# EAGLE design a22 (EAGLE 7.4.0)
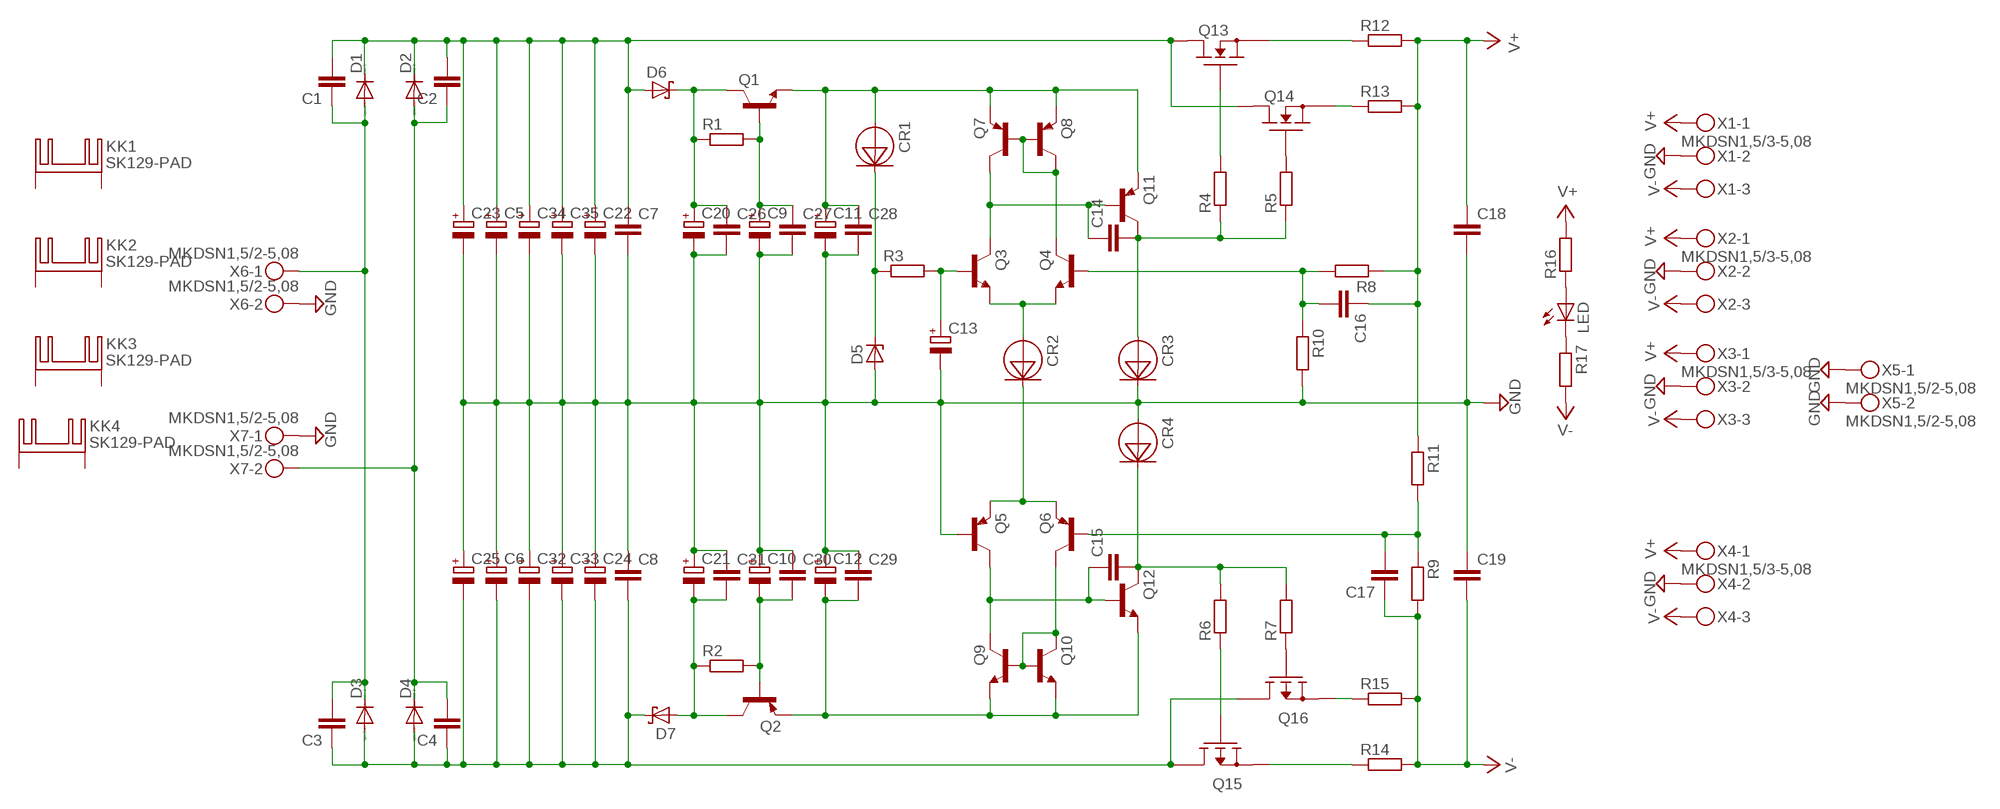
[diagram p0: schematic, sheet 1]

## Parts
C1  C-EU025_050-025X075  [C025_050-025X075]
C2  C-EU025_050-025X075  [C025_050-025X075]
C3  C-EU025_050-025X075  [C025_050-025X075]
C4  C-EU025_050-025X075  [C025_050-025X075]
C5  CPOL-EUE10-30  [EB30D]
C6  CPOL-EUE10-30  [EB30D]
C7  C-EU050-075X075  [C050-075X075]
C8  C-EU050-075X075  [C050-075X075]
C9  CPOL-EUE5-10.5  [E5-10,5]
C10  CPOL-EUE5-10.5  [E5-10,5]
C11  CPOL-EUE5-13  [E5-13]
C12  CPOL-EUE5-13  [E5-13]
C13  CPOL-EUE5-10.5  [E5-10,5]
C14  C-EU050-075X075  [C050-075X075]
C15  C-EU050-075X075  [C050-075X075]
C16  C-EU025_050-045X075  [C025_050-045X075]
C17  C-EU025_050-045X075  [C025_050-045X075]
C18  C-EU050-075X075  [C050-075X075]
C19  C-EU050-075X075  [C050-075X075]
C20  CPOL-EUE5-10.5  [E5-10,5]
C21  CPOL-EUE5-10.5  [E5-10,5]
C22  CPOL-EUE7.5-18  [E7,5-18]
C23  CPOL-EUE7.5-18  [E7,5-18]
C24  CPOL-EUE7.5-18  [E7,5-18]
C25  CPOL-EUE7.5-18  [E7,5-18]
C26  C-EU050-035X075  [C050-035X075]
C27  C-EU050-035X075  [C050-035X075]
C28  C-EU050-035X075  [C050-035X075]
C29  C-EU050-035X075  [C050-035X075]
C30  C-EU050-035X075  [C050-035X075]
C31  C-EU050-035X075  [C050-035X075]
C32  CPOL-EUE7.5-18  [E7,5-18]
C33  CPOL-EUE7.5-18  [E7,5-18]
C34  CPOL-EUE7.5-18  [E7,5-18]
C35  CPOL-EUE7.5-18  [E7,5-18]
CR1  E-202  [DO-35-3]
CR2  E-202  [DO-35-3]
CR3  E-202  [DO-35-3]
CR4  E-202  [DO-35-3]
D1  MUR810  [TO220ACS]
D2  MUR810  [TO220ACS]
D3  MUR810  [TO220ACS]
D4  MUR810  [TO220ACS]
D5  BZX90  [DO34Z7]
D6  1N5819-B  [DO41-7.6]
D7  1N5819-B  [DO41-7.6]
KK1  SK129-PAD  [SK129]
KK2  SK129-PAD  [SK129]
KK3  SK129-PAD  [SK129]
KK4  SK129-PAD  [SK129]
LED  LED5MM  [LED5MM]
Q1  BC550B  [TO92-EBC]
Q2  BC560C  [TO92-EBC]
Q3  BC550B  [TO92-EBC]
Q4  BC550B  [TO92-EBC]
Q5  BC560C  [TO92-EBC]
Q6  BC560C  [TO92-EBC]
Q7  BC560C  [TO92-EBC]
Q8  BC560C  [TO92-EBC]
Q9  BC550B  [TO92-EBC]
Q10  BC550B  [TO92-EBC]
Q11  BC560C  [TO92-EBC]
Q12  BC550B  [TO92-EBC]
Q13  IRFZ24N  [TO220V]
Q14  IRFZ24N  [TO220V]
Q15  IRF9Z34N  [TO220V]
Q16  IRF9Z34N  [TO220V]
R1  R-EU_0309/10  [0309/10]
R2  R-EU_0309/10  [0309/10]
R3  R-EU_0309/10  [0309/10]
R4  R-EU_0309/10  [0309/10]
R5  R-EU_0309/10  [0309/10]
R6  R-EU_0309/10  [0309/10]
R7  R-EU_0309/10  [0309/10]
R8  R-EU_0309/10  [0309/10]
R9  R-EU_0309/10  [0309/10]
R10  R-EU_0309/10  [0309/10]
R11  R-EU_0309/10  [0309/10]
R12  R-EU_0617/17  [0617/17]
R13  R-EU_0617/17  [0617/17]
R14  R-EU_0617/17  [0617/17]
R15  R-EU_0617/17  [0617/17]
R16  R-EU_0309/10  [0309/10]
R17  R-EU_0309/10  [0309/10]
X1  MKDSN1,5/3-5,08  [MKDSN1,5/3-5,08]
X2  MKDSN1,5/3-5,08  [MKDSN1,5/3-5,08]
X3  MKDSN1,5/3-5,08  [MKDSN1,5/3-5,08]
X4  MKDSN1,5/3-5,08  [MKDSN1,5/3-5,08]
X5  MKDSN1,5/2-5,08  [MKDSN1,5/2-5,08]
X6  MKDSN1,5/2-5,08  [MKDSN1,5/2-5,08]
X7  MKDSN1,5/2-5,08  [MKDSN1,5/2-5,08]

## Nets
GND: C5.- C6.+ C7.2 C8.1 C9.- C10.+ C11.- C12.+ C13.- C18.2 C19.1 C20.- C21.+ C22.- C23.- C24.+ C25.+ C26.2 C27.2 C28.2 C29.1 C30.1 C31.1 C32.+ C33.+ C34.- C35.- CR3.1(CATHODE) CR3.2(CATHODE) CR3.CATHODE CR4.ANODE D5.A Q5.B R10.2 X1.2 X2.2 X3.2 X4.2 X5.1 X5.2 X6.2 X7.1
N$1: C1.1 C3.2 C3.3 D1.A D3.C X6.1
N$2: C2.1 C4.2 C4.3 D2.A D4.C X7.2
N$3: C20.+ C26.1 D6.C Q1.C R1.1
N$4: Q13.1(G) R4.2
N$5: C9.+ C27.1 Q1.B R1.2
N$6: C10.- C30.2 Q2.B R2.2
N$7: C3.1 C4.1 C6.- C8.2 C24.- C25.- C32.- C33.- D3.A D4.A D7.C Q15.2(D) Q16.2(D)
N$8: C21.- C31.2 D7.A Q2.C R2.1
N$9: C11.+ C28.1 CR1.ANODE Q1.E Q7.E Q8.E Q11.E
N$10: LED.A R16.1
N$11: CR1.1(CATHODE) CR1.2(CATHODE) CR1.CATHODE D5.C R3.1
N$12: C12.- C29.2 Q2.E Q9.E Q10.E Q12.E
N$13: CR2.1(CATHODE) CR2.2(CATHODE) CR2.CATHODE Q5.E Q6.E
N$14: CR2.ANODE Q3.E Q4.E
N$15: C13.+ Q3.B R3.2
N$16: Q4.C Q7.B Q8.B Q8.C
N$17: Q6.C Q9.B Q10.B Q10.C
N$18: C15.1 Q5.C Q9.C Q12.B
N$19: C1.2 C1.3 C2.2 C2.3 C5.+ C7.1 C22.+ C23.+ C34.+ C35.+ D1.C D2.C D6.A Q13.2(D) Q14.2(D)
N$20: C17.2 C17.3 Q6.B R9.1 R11.2
N$21: C14.1 Q3.C Q7.C Q11.B
N$22: C14.2 CR3.ANODE Q11.C R4.1 R5.1
N$23: C15.2 CR4.1(CATHODE) CR4.2(CATHODE) CR4.CATHODE Q12.C R6.2 R7.2
N$24: Q14.1(G) R5.2
N$25: Q16.1(G) R7.1
N$26: LED.K(C) R17.1
N$27: Q15.1(G) R6.1
N$28: C16.2 C16.3 Q4.B R8.2 R10.1
N$30: Q16.3(S) R15.1
N$31: Q15.3(S) R14.1
N$33: Q13.3(S) R12.1
N$34: Q14.3(S) R13.1
V+: C16.1 C18.1 R8.1 R11.1 R12.2 R13.2 R16.2 X1.1 X2.1 X3.1 X4.1
V-: C17.1 C19.2 R9.2 R14.2 R15.2 R17.2 X1.3 X2.3 X3.3 X4.3
Unconnected: KK1.A2,5(K) KK1.B2,5(K) KK2.A2,5(K) KK2.B2,5(K) KK3.A2,5(K) KK3.B2,5(K) KK4.A2,5(K) KK4.B2,5(K)

## Library data of the parts
C1-C4 C7 C8 C14-C19 C26-C31 = Vwvwbg:C-EU: CAPACITOR, European symbol
C5 C6 C9-C13 C20-C25 C32-C35 = Vwvwbg:CPOL-EU: POLARIZED CAPACITOR, European symbol
CR1-CR4 = crd:E-202
D1-D4 = diode:MUR810: DIODE
D5 = diode:BZX90: Z DIODE
D6 D7 = diode:1N581*: 1.0A SCHOTTKY BARRIER RECTIFIER Source: http://www.diodes.com/datasheets/ds23001.pdf
KK1-KK4 = heatsinkfix:SK129-PAD: HEATSINK manufacturer Fischer/distributor Buerklin
LED = led:LED: LED OSRAM: - CHIPLED LG R971, LG N971, LY N971, LG Q971, LY Q971, LO R971, LY R971 LH N974, LH R974 LS Q976, LO Q976, LY Q976 LO Q996 - Hyper CHIPLED LW Q18S LB Q993, LB Q99A, LB R99A - SideLED LS A670, LO A670, LY A670, LG A670, LP A670 LB A673, LV A673, LT A673, LW A673 LH A674 LY A675 LS A676, LA A676, LO A676, LY A676, LW A676 LS A679, LY A679, LG A679 - Hyper Micro SIDELED® LS Y876, LA Y876, LO Y876, LY Y876 LT Y87S - SmartLED LW L88C, LW L88S LB L89C, LB L89S, LG L890 LS L89K, LO L89K, LY L89K LS L896, LA L896, LO L896, LY L896 - TOPLED LS T670, LO T670, LY T670, LG T670, LP T670 LSG T670, LSP T670, LSY T670, LOP T670, LYG T670 LG T671, LOG T671, LSG T671 LB T673, LV T673, LT T673, LW T673 LH T674 LS T676, LA T676, LO T676, LY T676, LB T676, LH T676, LSB T676, LW T676 LB T67C, LV T67C, LT T67C, LS T67K, LO T67K, LY T67K, LW E67C LS E67B, LA E67B, LO E67B, LY E67B, LB E67C, LV E67C, LT E67C LW T67C LS T679, LY T679, LG T679 LS T770, LO T770, LY T770, LG T770, LP T770 LB T773, LV T773, LT T773, LW T773 LH T774 LS E675, LA E675, LY E675, LS T675 LS T776, LA T776, LO T776, LY T776, LB T776 LHGB T686 LT T68C, LB T68C - Hyper Mini TOPLED® LB M676 - Mini TOPLED Santana® LG M470 LS M47K, LO M47K, LY M47K Source: http://www.osram.convergy.de LUXEON: - LUMILED® LXK2-PW12-R00, LXK2-PW12-S00, LXK2-PW14-U00, LXK2-PW14-V00 LXK2-PM12-R00, LXK2-PM12-S00, LXK2-PM14-U00 LXK2-PE12-Q00, LXK2-PE12-R00, LXK2-PE12-S00, LXK2-PE14-T00, LXK2-PE14-U00 LXK2-PB12-K00, LXK2-PB12-L00, LXK2-PB12-M00, LXK2-PB14-N00, LXK2-PB14-P00, LXK2-PB14-Q00 LXK2-PR12-L00, LXK2-PR12-M00, LXK2-PR14-Q00, LXK2-PR14-R00 LXK2-PD12-Q00, LXK2-PD12-R00, LXK2-PD12-S00 LXK2-PH12-R00, LXK2-PH12-S00 LXK2-PL12-P00, LXK2-PL12-Q00, LXK2-PL12-R00 Source: www.luxeon.com KINGBRIGHT: KA-3528ASYC Source: www.kingbright.com
Q1 Q3 Q4 Q9 Q10 Q12 = tranzistory NPN:BC550*: NPN Transistor
Q2 Q5-Q8 Q11 = transistor-pnp:BC560*: PNP Transistror
Q13 Q14 = transistor-fet:IRFZ24N
Q15 Q16 = transistor-fet:IRF9Z34N
R1-R17 = Vwvwbg:R-EU_: RESISTOR, European symbol
X1-X4 = con-phoenix-508:MKDSN1,5/3-5,08: MKDSN 1,5/ 3-5,08 Printklemme Nennstrom: 13,5 A Nennspannung: 250 V Rastermaß: 5,08 mm Polzahl: 3 Anschlussart: Schraubanschluss Montage: Löten Anschlussrichtung Leiter/Platine: 0 ° Artikelnummer: 1729131 Source: http://eshop.phoenixcontact.com .. 1729131.pdf
X5-X7 = con-phoenix-508:MKDSN1,5/2-5,08: MKDSN 1,5/ 2-5,08 Printklemme Nennstrom: 13,5 A Nennspannung: 250 V Rastermaß: 5,08 mm Polzahl: 2 Anschlussart: Schraubanschluss Montage: Löten Anschlussrichtung Leiter/Platine: 0 ° Artikelnummer: 1729128 Source: http://eshop.phoenixcontact.com .. 1729128.pdf

## Board
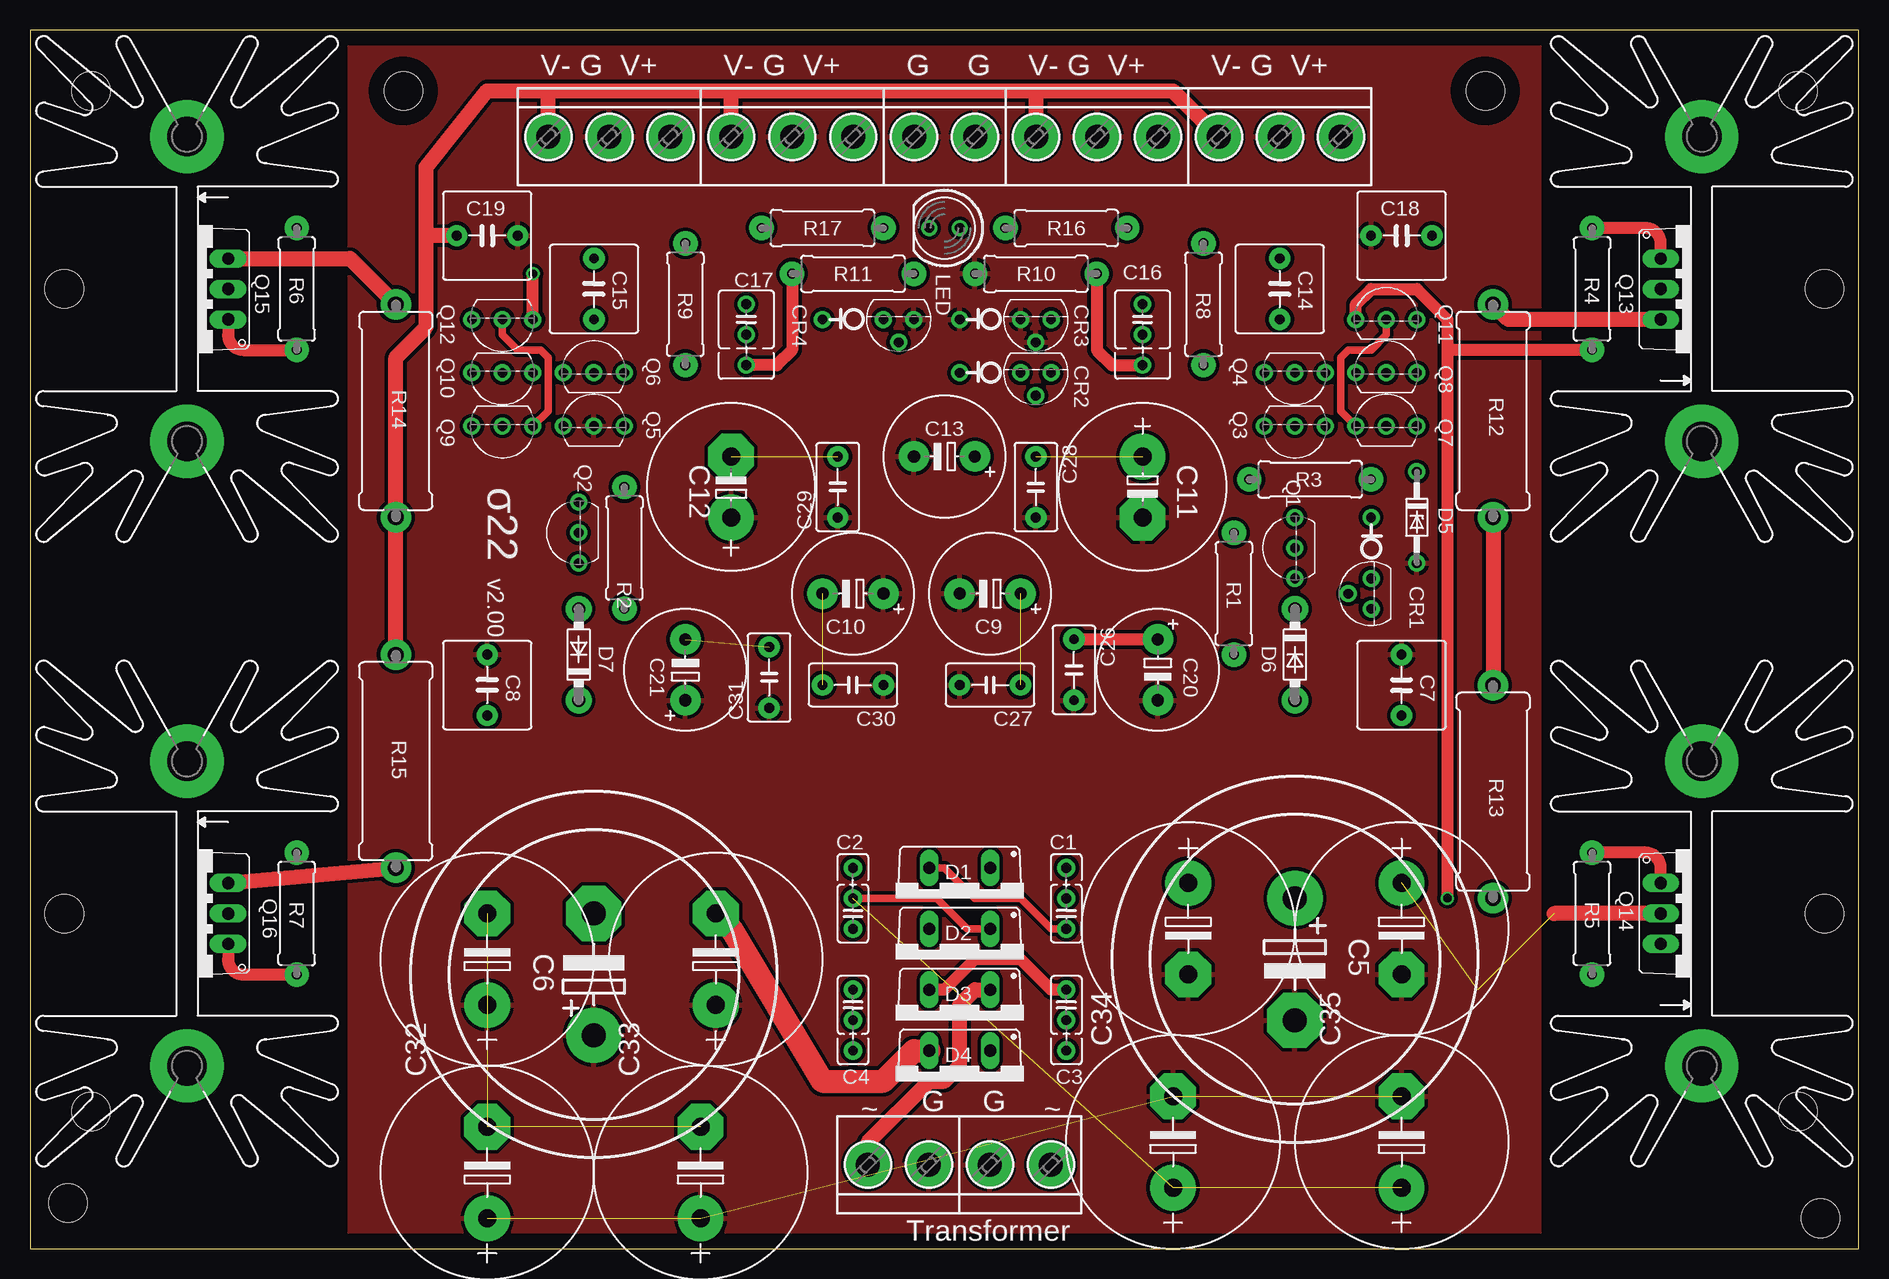
[diagram p1: board, top side]
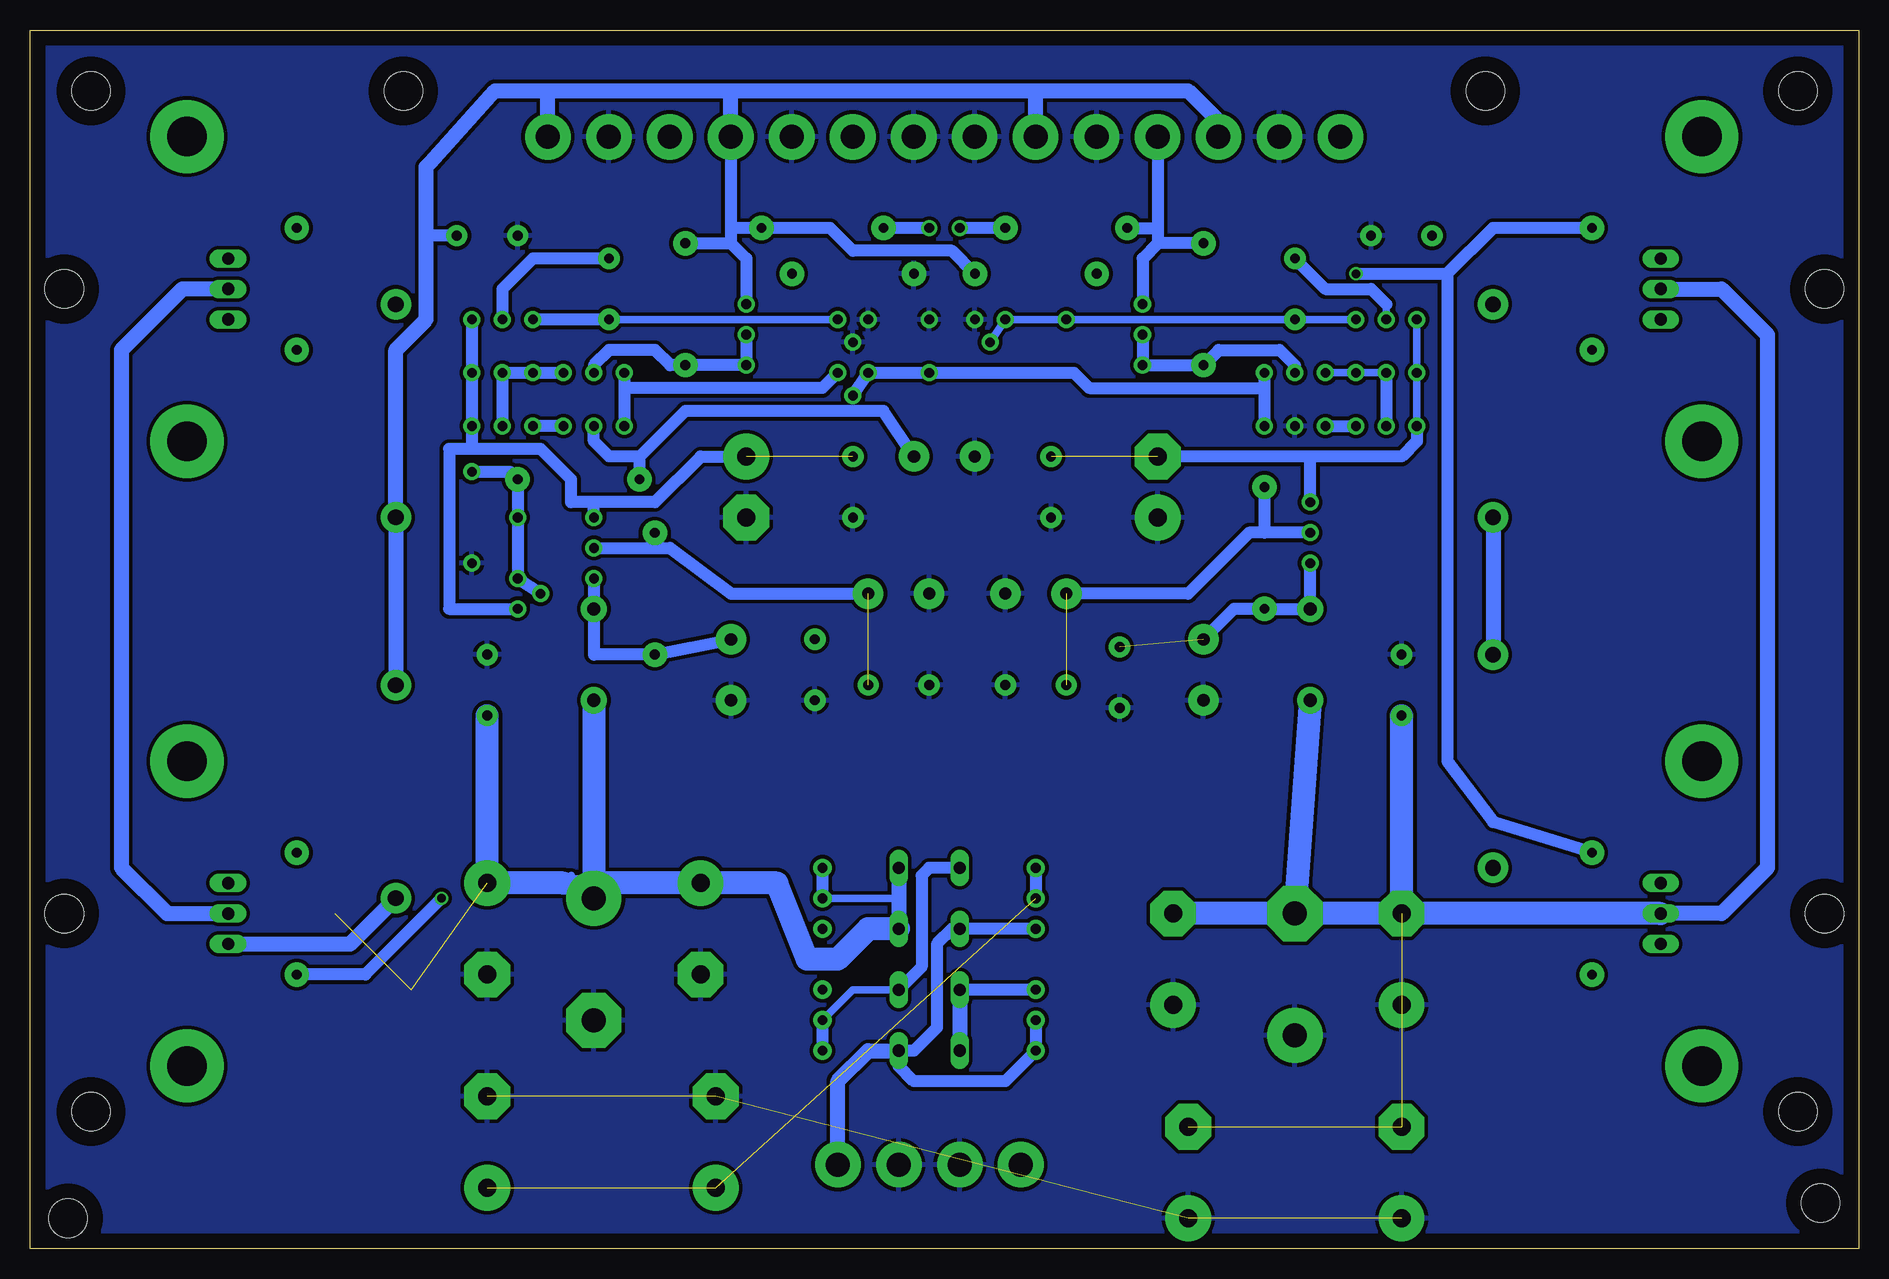
[diagram p2: board, bottom side, seen from below]

Size 152.4 x 101.6 mm. Coordinates in mm from the lower left corner, seen from the top.
Outline: 0,0 152.4,0 152.4,101.6 0,101.6 0,0
Copper layers (1*16): Top 0.035mm / dielectric 1.5mm / Bottom 0.035mm
Design rules "default *": minimum track width 10mil, minimum drill 24mil, track to track 8mil, track to pad 8mil, pad to pad 8mil, via to via 8mil, smd to smd 8mil, copper to edge 50mil, drill to drill 8mil, minimum pad ring 10mil, minimum via ring 8mil, stop-mask expansion 4mil, vias tented up to drill 0mil, thermal gap 12mil
Holes 3.2 mm at 3.17,3.81 149.22,2.54 121.28,96.52 31.11,96.52 2.86,80.01 2.86,27.94 149.54,80.01 149.54,27.94 5.08,11.43 147.32,11.43 5.08,96.52 147.32,96.52

### Footprints (pad centres in the part's own frame; a part is rotated, then mirrored left to right if it is on the bottom)
C025_050-025X075 = drill 0.813 pad 1.524: 1 -1.27,0; 2 1.27,0; 3 3.81,0
EB30D = drill 2.007 pad 4.597: + -5.08,0 | drill 2.007 pad 4.597 octagon: - 5.08,0
C050-075X075 = drill 0.813 pad 1.778: 1 -2.54,0; 2 2.54,0
E5-10,5 = drill 1.016 pad 2.54: + -2.54,0; - 2.54,0
E5-13 = drill 1.5 pad 3.81: + -2.54,0 | drill 1.5 pad 3.81 octagon: - 2.54,0
C025_050-045X075 = drill 0.813 pad 1.422: 1 -1.27,0; 2 1.27,0; 3 3.81,0
E7,5-18 = drill 1.5 pad 3.81: + -3.81,0 | drill 1.5 pad 3.81 octagon: - 3.81,0
C050-035X075 = drill 0.813 pad 1.778: 1 -2.54,0; 2 2.54,0
DO-35-3 = drill 0.813 pad 1.422: 1 -1.27,0; 2 -2.54,1.905; ANODE -3.81,0; CATHODE 3.81,0
TO220ACS = drill 1.016 long: A 2.54,-2.54; C -2.54,-2.54
DO34Z7 = drill 0.813 pad 1.422: A 3.81,0; C -3.81,0
DO41-7.6 = drill 1.1 pad 2.184: A 3.81,0; C -3.81,0
SK129 = drill 3.302 pad 6.096: A2,5 -12.7,-0.889; B2,5 12.7,-0.889
LED5MM = drill 0.813: A -1.27,0; K 1.27,0
TO92-EBC = drill 0.813 pad 1.422: B 0,-1.27; C -2.54,-1.27; E 2.54,-1.27
TO220V = drill 1.016 long: 1 -2.54,-2.54; 2 0,-2.54; 3 2.54,-2.54
0309/10 = drill 0.813 pad 2.032: 1 -5.08,0; 2 5.08,0
0617/17 = drill 1.3 pad 2.54: 1 -8.89,0; 2 8.89,0
MKDSN1,5/3-5,08 = drill 2 pad 3.81: 1 -7.641,0.025; 2 -2.561,0.025; 3 2.519,0.025
MKDSN1,5/2-5,08 = drill 2 pad 3.81: 1 -2.561,0.025; 2 2.519,0.025

### Placement (x,y rotation side)
C1  86.36,27.94 90 top
C2  68.58,27.94 90 top
C3  86.36,20.32 270 top
C4  68.58,20.32 270 top
C5  105.41,24.13 270 top
C6  46.99,22.86 90 top
C7  114.3,46.99 90 top
C8  38.1,46.99 270 top
C9  80.01,54.61 180 top
C10  68.58,54.61 180 top
C11  92.71,63.5 270 top
C12  58.42,63.5 90 top
C13  76.2,66.04 180 top
C14  104.14,80.01 270 top
C15  46.99,80.01 270 top
C16  92.71,77.47 270 top
C17  59.69,77.47 270 top
C18  114.3,84.45 180 top
C19  38.1,84.45 180 top
C20  93.98,48.26 270 top
C21  54.61,48.26 90 top
C22  114.3,26.67 270 top
C23  96.52,26.67 270 top
C24  57.15,24.13 90 top
C25  38.1,24.13 90 top
C26  87,48.26 270 top
C27  80.01,46.99 180 top
C28  83.82,63.5 270 top
C29  67.31,63.5 90 top
C30  68.58,46.99 180 top
C31  61.59,47.62 90 top
C32  38.1,6.35 90 top
C33  55.88,6.35 90 top
C34  95.25,8.89 90 top
C35  114.3,8.89 90 top
CR1  111.76,57.15 90 top
CR2  81.28,73.03 180 top
CR3  81.28,77.47 180 top
CR4  69.85,77.47 180 top
D1  77.47,29.21 180 top
D2  77.47,24.13 180 top
D3  77.47,19.05 180 top
D4  77.47,13.97 180 top
D5  115.57,60.96 270 top
D6  105.41,49.53 270 top
D7  45.72,49.53 90 top
KK1  13.97,27.94 270 top
KK2  13.97,80.01 270 top
KK3  138.43,27.94 90 top
KK4  138.43,80.01 90 top
LED  76.2,85.09 180 top
Q1  104.14,58.42 90 top
Q2  44.45,59.69 90 top
Q3  105.41,67.31 180 top
Q4  105.41,71.75 180 top
Q5  46.99,69.85 0 top
Q6  46.99,74.3 0 top
Q7  113.03,69.85 0 top
Q8  113.03,74.3 0 top
Q9  39.37,67.31 180 top
Q10  39.37,71.75 180 top
Q11  113.03,78.74 0 top
Q12  39.37,76.2 180 top
Q13  138.43,80.01 270 top
Q14  138.43,27.94 270 top
Q15  13.97,80.01 90 top
Q16  13.97,27.94 90 top
R1  100.33,54.61 90 top
R2  49.53,58.42 90 top
R3  106.68,64.14 180 top
R4  130.18,80.01 90 top
R5  130.18,27.94 90 top
R6  22.23,80.01 90 top
R7  22.23,27.94 90 top
R8  97.79,78.74 270 top
R9  54.61,78.74 90 top
R10  83.82,81.28 180 top
R11  68.58,81.28 180 top
R12  121.92,69.85 270 top
R13  121.92,38.1 90 top
R14  30.48,69.85 270 top
R15  30.48,40.64 90 top
R16  86.36,85.09 0 top
R17  66.04,85.09 180 top
X1  101.6,92.71 180 top
X2  60.96,92.71 180 top
X3  45.72,92.71 180 top
X4  86.36,92.71 180 top
X5  76.2,92.71 180 top
X6  72.39,6.98 0 top
X7  82.55,6.98 0 top

### Tracks (layer width: path | path; a pad name or v marks a point on that pad's centre or on a via)
GND  (3 unrouted)
  pour Bottom (isolate 0.305): 0,101.6 152.4,101.6 152.4,0 0,0
  pour Top (isolate 0.305): 26.67,101.6 125.73,101.6 125.73,0 26.67,0
N$1
  Top 0.61: C1.1 85.09,26.67 82.55,29.21 78.74,29.21 76.2,31.75 D1.A
  Top 1.27: X6.1 69.83,8.87 74.93,13.97 76.2,13.97 77.47,15.24 77.47,20.32 78.74,21.59 D3.C
  Bottom 0.61: C3.2 83.82,21.59 D3.C
  Bottom 1.016: C3.2 C3.3 | D1.A 77.47,31.75 78.11,31.11 78.11,23.49 D3.C
N$2
  Bottom 1.016: C4.2 C4.3 71.12,13.97 78.74,13.97 80.01,15.24 D4.C 78.74,16.51 76.83,18.41 76.83,25.4 75.56,26.67 D2.A C2.1
  Bottom 1.27: X7.2 85.07,13.99 82.55,16.51 D4.C
N$3
  Top 1.016: C20.+ C26.1
  Bottom 1.016: C20.+ R1.1 105.41,49.53 D6.C Q1.C
N$4
  Top 1.016: Q13.1 135.89,83.82 arc90 134.62,85.09 R4.2
N$5  (1 unrouted)
  Bottom 1.016: Q1.B 100.33,58.42 | 100.33,58.42 99.06,58.42 93.98,54.61 C9.+ | R1.2 100.33,58.42
N$6  (1 unrouted)
  Bottom 1.016: Q2.B 49.53,59.69 | 49.53,59.69 50.8,59.69 55.88,54.61 C10.- | R2.2 49.53,59.69
N$7  (2 unrouted)
  Top 1.016: C3.1 85.09,21.59 82.55,24.13 78.74,24.13 76.2,21.59 D3.A
  Top 1.93: C24.- 58.42,26.67 66.04,13.97 71.12,13.97 73.66,16.51 D4.A
  Bottom 1.016: C4.1 D3.A
  Bottom 1.27: Q15.2 11.43,80.01 7.62,76.2 7.62,31.75 11.43,27.94 Q16.2 | D3.A D4.A
  Bottom 1.93: Q16.2 C25.- | C25.- C6.- | C6.- C24.- | C25.- C8.2 | D7.C C6.-
N$8  (1 unrouted)
  Bottom 1.016: Q2.C D7.A R2.1 52.07,53.34 C21.-
N$9  (1 unrouted)
  Bottom 1.016: Q11.E Q8.E Q7.E 115.57,66.67 | 115.57,66.67 117.47,66.67 117.47,53.34 CR1.ANODE | 115.57,66.67 109.86,66.67 107.31,64.14 107.31,62.23 105.41,62.23 | 105.41,62.23 100.33,62.23 96.52,66.04 C11.+ | Q1.E 105.41,62.23
N$10
  Bottom 1.016: LED.A R16.1
N$11
  Bottom 1.016: D5.C 112.39,64.77 R3.1 CR1.CATHODE CR1.1 CR1.2
N$12  (1 unrouted)
  Bottom 0.61: Q12.E Q10.E Q9.E
  Bottom 1.016: Q9.E 36.83,67.31 38.1,66.04 45.72,66.04 | 45.72,66.04 C12.- | Q2.E 45.72,66.04
N$13
  Bottom 0.61: 49.53,71.75 Q6.E
  Bottom 1.016: CR2.2 CR2.1 CR2.CATHODE 65.41,73.03 64.14,71.75 49.53,71.75 | Q6.E Q5.E
N$14
  Bottom 1.016: CR2.ANODE 86.36,71.75 102.87,71.75 | Q4.E 102.87,71.75 | 102.87,71.75 Q3.E
N$15
  Bottom 1.016: C13.+ 81.28,69.85 97.79,69.85 101.6,66.04 | R3.2 101.6,66.04 | 101.6,66.04 104.14,66.04 105.41,67.31 Q3.B
N$16
  Bottom 1.016: Q7.B Q8.B Q8.C Q4.C
N$17
  Bottom 0.61: Q10.B Q10.C Q6.C
  Bottom 1.016: Q10.B Q9.B
N$18
  Top 0.61: Q9.C 43.18,69.85 43.18,74.3 42.55,74.93 40.64,74.93 39.37,76.2 Q12.B
  Bottom 0.61: 39.37,78.74 Q12.B
  Bottom 1.016: C15.1 44.45,80.01 40.64,80.01 39.37,78.74 | Q5.C Q9.C
N$19  (4 unrouted)
  Top 0.61: C2.2 75.56,29.21 78.11,26.67 D2.C
  Top 1.27: Q14.2 127,27.94
  Bottom 0.61: C1.2 80.01,29.21 | 107.31,31.11 107.95,30.48
  Bottom 1.016: C1.3 C1.2 | C2.3 C2.2
  Bottom 1.27: Q13.2 139.7,80.01 144.78,74.93 144.78,31.75 140.97,27.94 Q14.2 | 105.41,30.48 107.95,30.48 | D1.C 80.01,29.21 D2.C
  Bottom 1.93: D2.C 82.55,26.67 85.09,24.13 87.63,24.13 90.17,30.48 C23.+ 105.41,30.48 C5.+ D6.A | 107.95,30.48 C22.+ C7.1
N$20
  Top 1.016: R11.2 63.5,74.93 62.23,73.66 C17.3
  Bottom 1.016: C17.2 C17.3 R9.1 53.34,74.93 48.26,74.93 46.99,73.66 Q6.B
N$21
  Top 0.61: Q11.B 113.03,76.2 111.76,74.93 109.86,74.93 109.22,74.3 109.22,69.85 Q7.C
  Bottom 1.016: C14.1 110.49,82.55 113.03,80.01 Q11.B | Q3.C Q7.C
N$22  (via drill 0.7)
  Top 1.016: Q11.C 110.49,78.74 111.76,80.01 115.57,80.01 118.11,77.47 118.11,74.93 | 118.11,74.93 v118.11,29.21 | R4.1 118.11,74.93
  Bottom 0.61: CR3.ANODE C14.2
  Bottom 1.016: v118.11,29.21 124.46,22.86 R5.1 | C14.2 Q11.C
N$23  (via drill 0.7 pad 1.02)
  Top 1.016: Q12.C v41.91,81.28
  Bottom 0.61: Q12.C C15.2 CR4.CATHODE CR4.1 CR4.2
  Bottom 1.016: R6.2 30.48,85.09 34.29,81.28 | 34.29,81.28 34.29,40.64 30.48,35.56 R7.2 | v41.91,81.28 34.29,81.28
N$24
  Top 1.016: Q14.1 135.89,31.75 arc90 134.62,33.02 R5.2
N$25
  Top 1.016: Q16.1 16.51,24.13 arc90 17.78,22.86 R7.1
N$26
  Bottom 1.016: R17.1 LED.K
N$27
  Top 1.016: Q15.1 16.51,76.2 arc90 17.78,74.93 R6.1
N$28
  Top 1.016: R10.1 88.9,74.93 90.17,73.66 C16.3
  Bottom 1.016: C16.2 C16.3 R8.2 99.06,73.66 100.33,74.93 104.14,74.93 105.41,73.66 Q4.B
N$30
  Top 1.27: Q16.3 R15.1
N$31
  Top 1.27: Q15.3 26.67,82.55 R14.1
N$33
  Top 1.27: Q13.3 123.19,77.47 R12.1
N$34
  Bottom 1.27: Q14.3 125.73,25.4 R13.1
V+
  Top 1.27: R12.2 R13.2
  Bottom 1.016: C18.1 119.38,84.45 | X4.1 94,85.09 | 94,85.09 94,83.84 | 94,83.84 92.71,82.55 C16.1 | 94,85.09 R16.2 85.72,85.09 83.82,83.19 75.56,83.19 R11.1 | R8.1 94.02,83.82 94,83.84
  Bottom 1.27: R13.2 R12.2 121.92,74.93 119.38,77.47 119.38,84.45 119.38,90.17 113.67,96.52 109.22,96.52 | 109.22,96.52 93.98,96.52 | 93.98,96.52 68.58,96.52 | 68.58,96.52 55.88,96.52 53.34,93.98 53.34,92.71 X3.1 | X2.1 68.6,96.5 68.58,96.52 | X4.1 94,96.5 93.98,96.52 | X1.1 109.24,96.5 109.22,96.52
V-
  Top 1.27: R15.2 R14.2 30.48,74.3 33.02,76.84 33.02,84.45 | 33.02,84.45 33.02,90.17 38.1,96.52 43.18,96.52 | 43.18,96.52 58.42,96.52 | 58.42,96.52 83.82,96.52 | 83.82,96.52 95.25,96.52 X1.3 | C19.2 33.02,84.45 | X3.3 43.2,96.5 43.18,96.52 | X2.3 58.44,96.5 58.42,96.52 | X4.3 83.84,96.5 83.82,96.52
  Bottom 1.016: 58.42,83.82 58.44,83.84 58.44,85.09 | 58.42,83.82 59.69,82.55 C17.1 | R9.2 58.42,83.82 | X2.3 58.44,85.09 | R17.2 58.44,85.09
  Bottom 1.27: R14.2 R15.2

### Text on the board
tPlace: V- G V+ | V- G V+ | G | G | V- G V+ | V- G V+ | σ22 | v2.00 | G | G | ~ | ~ | Transformer